# EasyEDA Pro project HNDX.eprj, board PCB1_3
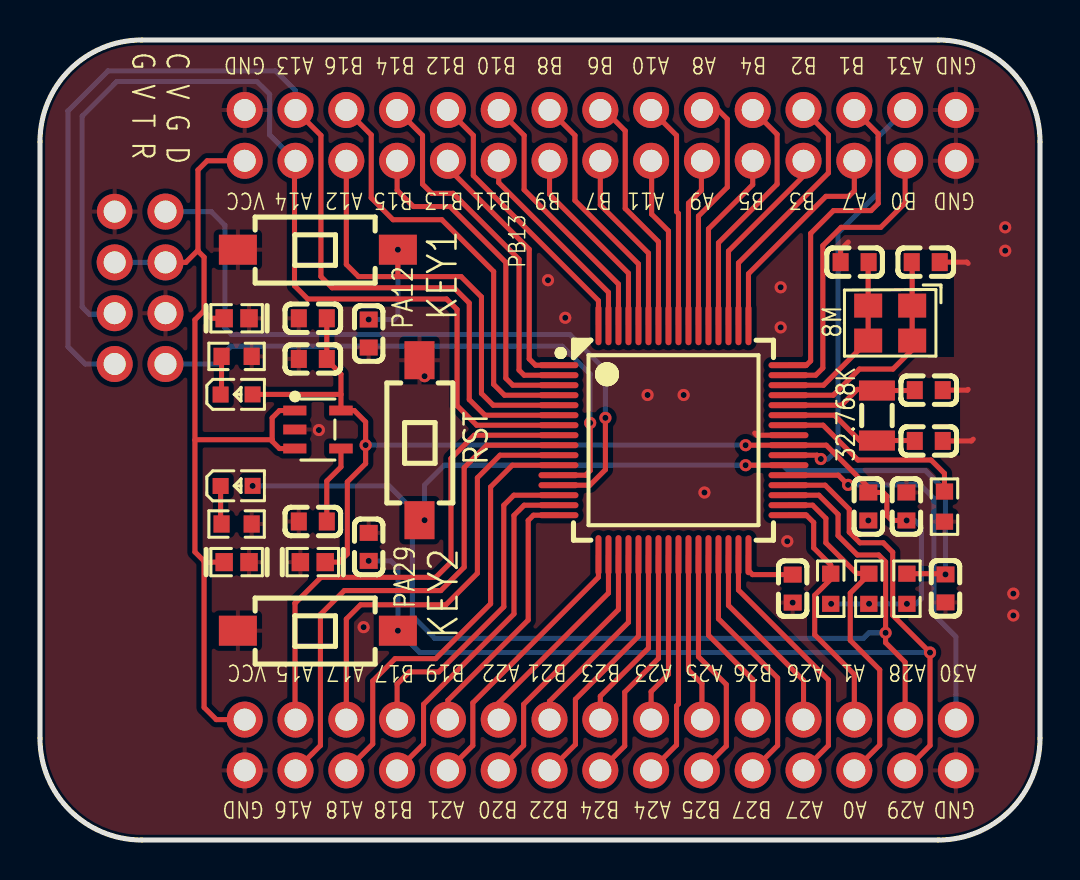
[diagram p9: board, top side]
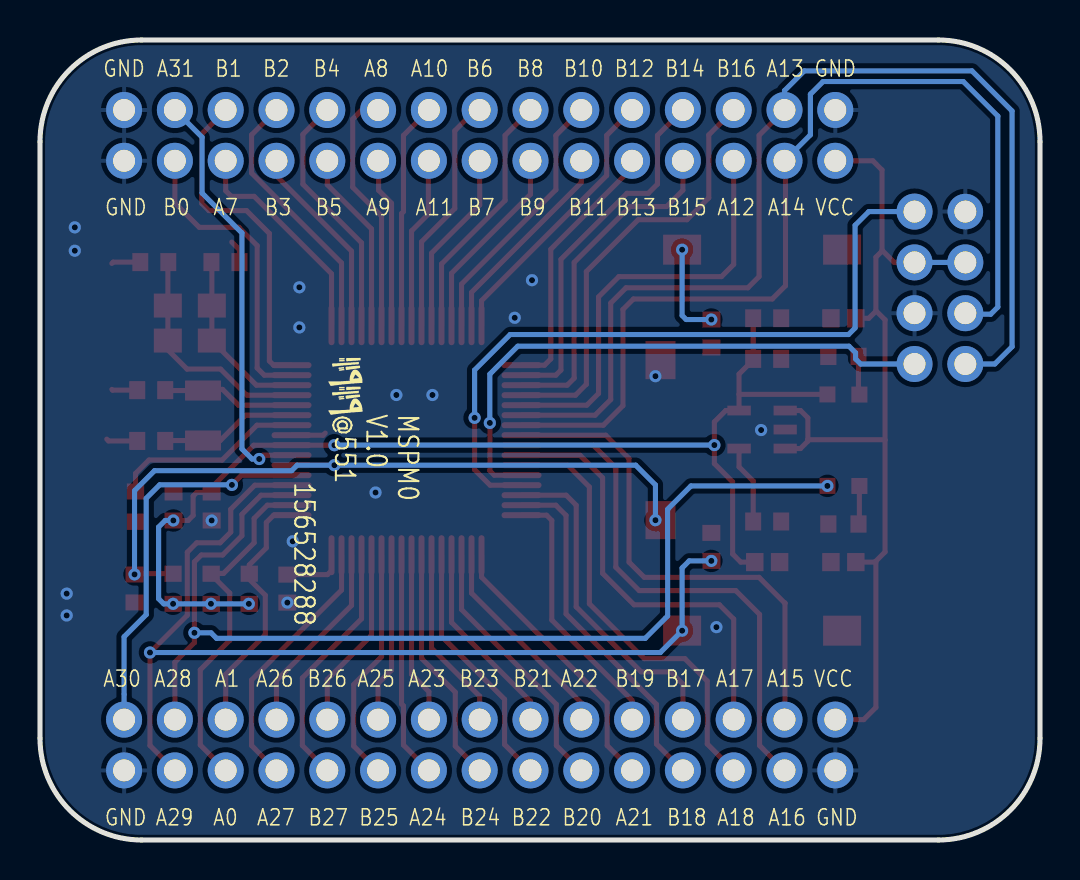
[diagram p10: board, bottom side, seen from below]

Outline 50 x 40 mm; copper layers: Top Layer, Bottom Layer. Coordinates in mm from the lower left corner of the outline.
Outline path: 0,34.92 arc(1.49,38.51) 5.08,40 44.92,40 arc(48.51,38.51) 50,34.92 50,5.08 arc(48.51,1.49) 44.92,0 5.08,0 arc(1.49,1.49) 0,5.08 0,34.92
Stack: Top Layer 0.035mm / Dielectric1 1.51mm FR4 er 4.5 / Bottom Layer 0.035mm

## Design rules (mm)
template: JLCPCB Capability(Two Layers Board)
spacing copperThickness1oz (default): track to track 0.102, other pairs 0.152 to 0.3
spacing copperThickness2oz: track to track 0.203, other pairs 0.152 to 0.3
track width copperThickness1oz (default): min 0.127, default 0.254, max 2.54
track width copperThickness2oz: min 0.203, default 0.254, max 2.54
differential pair differentialPair (default): width min 0.127, default 0.254, max 2.54; gap min 0.152, default 0.152
via viaSize (default): diameter min 0.5, default 0.61, max 10; hole min 0.3, default 0.305, max 6.3

## Placement (name value [footprint] x y rotation side)
C1  10nF  [C0603]  45.27 12.58 90 top
C2  470nF  [C0603]  37.63 12.57 90 top
C3  10uF  [C0603]  43.32 16.68 270 top
C4  100nF  [C0603]  41.42 16.68 90 top
C5  22nF  [C0603]  13.64 15.93 0 top
C6  100nF  [C0603]  13.64 24.05 180 top
C7  10uF  [C0603]  13.64 26.09 180 top
C8  100nF  [C0603]  16.43 25.32 270 top
C9  100nF  [C0603]  16.43 14.66 270 top
C10  20pF  [C0603]  44.44 22.49 180 top
C11  20pF  [C0603]  44.44 19.95 180 top
C12  20pF  [C0603]  40.73 28.89 0 top
C13  20pF  [C0603]  44.29 28.89 180 top
D4  0603ESDA-05N  [D0603-BI]  9.83 13.89 180 top
D5  0603ESDA-05N  [D0603-BI]  13.64 13.89 0 top
D6  0603ESDA-05N  [D0603-BI]  9.83 26.09 180 top
H3  PZ254R-12-8P  [HDR-TH_8P-P2.54-H-M-R2-C4-S2.54]  5 27.61 270 top
LED1  NCD0603R1  [LED0603-RD_RED]  9.83 17.7 0 top
LED2  NCD0603R1  [LED0603-RD_RED]  9.83 22.28 0 top
R1  47kΩ  [R0603]  43.35 12.56 270 top
R2  1kΩ  [R0603]  41.44 12.56 270 top
R3  1kΩ  [R0603]  39.54 12.56 90 top
R4  100kΩ  [R0603]  45.22 16.67 90 top
R5  1kΩ  [R0603]  9.83 15.8 180 top
R6  1kΩ  [R0603]  9.83 24.18 180 top
SW1  TS-1101-C-W  [SW-SMD_L6.0-W3.3-LS8.0]  18.97 19.99 90 top
SW2  TS-1101-C-W  [SW-SMD_L6.0-W3.3-LS8.0]  13.89 29.52 0 top
SW3  TS-1101-C-W  [SW-SMD_L6.0-W3.3-LS8.0]  13.89 10.47 0 top
U2  RT9193  [SOT-23-5_L3.0-W1.7-P0.95-LS2.8-BL]  13.89 20.52 270 top
U3  MSPM0G3507SPMR  [LQFP-64_L10.0-W10.0-P0.50-LS12.0-BL]  31.67 19.99 270 top
U12  PZ254-2-15-Z-8.5  [HDR-TH_30P-P2.54-V-M-R2-C15-S2.54]  28.02 35.23 0 top
U13  PZ254-2-15-Z-8.5  [HDR-TH_30P-P2.54-V-M-R2-C15-S2.54]  28.02 4.75 0 top
X1  32.768kHz  [FC-135R_L3.2-W1.5]  41.85 21.22 90 top
X2  8MHz  [CRYSTAL-SMD_4P-L3.2-W2.5-BL-1]  42.51 25.85 180 top

## Footprints (pads in the part's own frame, mm; a bottom-side part is the same pattern mirrored in y, then rotated)
C0603
  rect 0.8x0.9 smd: 1(-0.7,0) 2(0.7,0)
CRYSTAL-SMD_4P-L3.2-W2.5-BL-1
  rect 1.4x1.2 smd: 1(-1.1,-0.875) 2(1.1,-0.875) 3(1.1,0.875) 4(-1.1,0.875)
D0603-BI
  rect 0.873x0.907 smd: 1(-0.622,0) 2(0.622,0)
FC-135R_L3.2-W1.5
  rect 1x1.8 smd: 1(-1.25,0) 2(1.25,0)
HDR-TH_8P-P2.54-H-M-R2-C4-S2.54
  round 1.778 hole 1.1: 1(-3.81,-1.27)
  round 1.8 hole 1.1: 2(-3.81,1.27) 3(-1.27,-1.27) 4(-1.27,1.27) 5(1.27,-1.27) 6(1.27,1.27) 7(3.81,-1.27) 8(3.81,1.27)
HDR-TH_30P-P2.54-V-M-R2-C15-S2.54
  round 1.8 hole 1.1: 1(-17.78,-1.27) 2(-17.78,1.27) 3(-15.24,-1.27) 4(-15.24,1.27) 5(-12.7,-1.27) 6(-12.7,1.27) 7(-10.16,-1.27) 8(-10.16,1.27) 9(-7.62,-1.27) 10(-7.62,1.27) 11(-5.08,-1.27) 12(-5.08,1.27) 13(-2.54,-1.27) 14(-2.54,1.27) 15(0,-1.27) 16(0,1.27) 17(2.54,-1.27) 18(2.54,1.27) 19(5.08,-1.27) 20(5.08,1.27) 21(7.62,-1.27) 22(7.62,1.27) 23(10.16,-1.27) 24(10.16,1.27) 25(12.7,-1.27) 26(12.7,1.27) 27(15.24,-1.27) 28(15.24,1.27) 29(17.78,-1.27) 30(17.78,1.27)
LED0603-RD_RED
  rect 0.8x0.8 smd: 1(-0.799,-0.004) 2(0.799,0.004)
LQFP-64_L10.0-W10.0-P0.50-LS12.0-BL
  oval 0.3x2 smd: 1(-3.75,-5.75) 2(-3.25,-5.75) 3(-2.75,-5.75) 4(-2.25,-5.75) 5(-1.75,-5.75) 6(-1.25,-5.75) 7(-0.75,-5.75) 8(-0.25,-5.75) 9(0.25,-5.75) 10(0.75,-5.75) 11(1.25,-5.75) 12(1.75,-5.75) 13(2.25,-5.75) 14(2.75,-5.75) 15(3.25,-5.75) 16(3.75,-5.75) 33(3.75,5.75) 34(3.25,5.75) 35(2.75,5.75) 36(2.25,5.75) 37(1.75,5.75) 38(1.25,5.75) 39(0.75,5.75) 40(0.25,5.75) 41(-0.25,5.75) 42(-0.75,5.75) 43(-1.25,5.75) 44(-1.75,5.75) 45(-2.25,5.75) 46(-2.75,5.75) 47(-3.25,5.75) 48(-3.75,5.75)
  oval 2x0.3 smd: 17(5.75,-3.75) 18(5.75,-3.25) 19(5.75,-2.75) 20(5.75,-2.25) 21(5.75,-1.75) 22(5.75,-1.25) 23(5.75,-0.75) 24(5.75,-0.25) 25(5.75,0.25) 26(5.75,0.75) 27(5.75,1.25) 28(5.75,1.75) 29(5.75,2.25) 30(5.75,2.75) 31(5.75,3.25) 32(5.75,3.75) 49(-5.75,3.75) 50(-5.75,3.25) 51(-5.75,2.75) 52(-5.75,2.25) 53(-5.75,1.75) 54(-5.75,1.25) 55(-5.75,0.75) 56(-5.75,0.25) 57(-5.75,-0.25) 58(-5.75,-0.75) 59(-5.75,-1.25) 60(-5.75,-1.75) 61(-5.75,-2.25) 62(-5.75,-2.75) 63(-5.75,-3.25) 64(-5.75,-3.75)
R0603
  rect 0.806x0.864 smd: 1(-0.753,0) 2(0.753,0)
SOT-23-5_L3.0-W1.7-P0.95-LS2.8-BL
  rect 0.49x1.157 smd: 1(-0.95,-1.153) 2(0,-1.153) 3(0.95,-1.153)
  rect 0.49x1.175 smd: 4(0.95,1.153) 5(-0.95,1.153)
SW-SMD_L6.0-W3.3-LS8.0
  rect 1.9x1.5 smd: 1(-4,0) 2(4,0)

## Nets
As in the schematic.

## Via types
v1: diameter 0.61, hole 0.305, Top Layer to Bottom Layer, 37 vias

## Routing (per net, layer and track width the routed paths; a pad name or vN(x,y) marks a point on that pad's centre or on a via; arc(x,y) is an arc through that point)
3V3: length 57.4
  Top Layer w0.254: v1(35.28,19.74) U3.40 39.31,19.74 41.42,17.64 C4.2 42.16,17.38 42.34,17.2 42.34,16.23 42.6,15.98 C3.2 ; C7.1 C6.1 14.34,24 15.05,23.3 U2.5 15.71,21.47 16.28,20.9 v1(16.28,19.75) 16.28,18.82 15.37,17.91 15.37,14.3 14.96,13.89 D5.2 ; LED2.2 15.05,22.28
  Bottom Layer w0.254: v1(39.56,11.81) v1(43.35,11.81) 43.81,11.81 44.07,12.07 44.07,15.65 43.74,15.98 v1(43.33,15.98) ; v1(16.28,19.75) 35.28,19.75 v1(35.28,19.74)
  vias: v1(41.45,11.81)
GND: length 7.2
  Top Layer w0.254: 35.74,20.35 35.84,20.24 U3.41 ; C10.1 46.37,22.49 46.41,22.53 ; C13.1 46.34,28.89 46.41,28.83 ; 46.66,20.04 46.57,19.95 C11.1 ; 40.41,29.9 40.03,29.51 C12.1
  vias: v1(13.94,20.5) v1(16.18,10.64) v1(19.23,23.19) v1(25.4,27.99) v1(26.26,26.11) v1(30.38,22.25) v1(32.18,22.25) v1(33.22,17.37) v1(37.03,27.64) v1(37.03,25.63) v1(37.36,14.94) v1(37.63,11.87) v1(41.42,15.98) v1(48.26,30.63) v1(48.26,29.46) v1(48.67,12.32) v1(48.67,11.23)
VCC: length 46.4
  Top Layer w0.254: 7.88,29.47 7.29,28.88 H3.4 ; 7.88,29.47 7.9,29.49 7.9,33.5 8.36,33.96 U12.1 ; 7.88,29.47 8.2,29.14 8.2,26.47 ; 8.22,13.93 7.75,14.4 7.75,20 ; 8.22,13.93 8.2,13.91 8.2,6.63 8.81,6.02 U13.2 ; 8.22,13.93 8.25,13.89 D4.2 ; U2.1 11.97,21.47 11.61,21.11 11.61,20.01 ; 7.75,20 7.76,20.01 11.61,20.01 ; 7.75,20 7.75,26.01 8.2,26.47 ; 8.2,26.47 8.2,26.44 8.56,26.09 D6.2 ; 11.61,20.01 11.61,19.94 11.97,19.57 U2.3
  Bottom Layer w0.254: H3.3 H3.4
H_IN_1: length 8.7
  Top Layer w0.254: C12.2 41.41,28.87 X2.2 X2.3 39.18,22.74 37.53,22.74
H_IN_2: length 11.4
  Top Layer w0.254: 37.53,22.24 39.66,22.24 40.97,23.55 42.65,23.55 43.61,24.51 X2.4 X2.1 43.61,28.87 C13.2
L_IN_1: length 6.6
  Top Layer w0.254: C10.2 43.72,22.47 X1.2 41.79,22.53 40.87,22.53 40.08,21.74 37.53,21.74
L_IN_2: length 6.7
  Top Layer w0.254: C11.2 43.72,19.97 X1.1 40.99,19.97 39.72,21.24 37.53,21.24
NRST: length 37
  Top Layer w0.254: v1(35.28,18.74) U3.38 ; R1.1 45.24,13.32 v1(45.27,13.28)
  Bottom Layer w0.254: v1(19.23,15.99) 19.23,17.75 20.21,18.74 v1(35.28,18.74) 37.14,18.74 37.42,18.47 44.27,18.47 45.27,17.46 v1(45.27,13.28)
PA0: length 17.5
  Top Layer w0.254: 41.43,13.33 41.43,13.26 40.51,12.34 40.51,9.98 41.99,8.51 41.99,4.75 U13.25 ; 41.43,13.33 R2.1 ; 41.43,13.33 40.82,13.33 39.29,14.86 39.29,16.08 38.63,16.74 U3.34
PA1: length 12.8
  Top Layer w0.254: U3.33 38.32,16.24 38.68,15.88 38.68,14.61 39.54,13.75 R3.2 39.54,13.04 38.74,12.24 38.74,10.26 40.72,8.28 U13.26
PA7: length 11.1
  Top Layer w0.254: U3.49 35.42,28.31 39.29,32.18 40.44,32.18 40.72,32.46 U12.25
PA8: length 12.4
  Top Layer w0.254: U12.20 33.91,36.5 34.37,36.04 34.37,32.64 32.92,31.2 U3.54
PA9: length 8.5
  Top Layer w0.254: U3.55 32.42,31.84 33.07,32.49 33.07,33.93 U12.19
PA10: length 11.3
  Top Layer w0.254: U3.56 31.92,31.32 31.83,31.42 31.83,35.23 U12.18
PA11: length 8.6
  Top Layer w0.254: U3.57 31.42,30.45 30.58,31.29 30.58,33.93 U12.17
PA12: length 27.7
  Top Layer w0.254: 17.91,28.22 17.89,28.23 v1(17.89,29.52) ; U3.5 22.66,21.74 22.07,22.33 22.07,27.15 21.06,28.17 15.93,28.17 15.32,28.78 U12.5
  Bottom Layer w0.254: v1(17.89,29.52) 17.89,26.23 17.69,26.02 v1(16.43,26.02)
PA13: length 54.5
  Top Layer w0.254: U12.4 14.05,35.23 14.05,28.17 14.61,27.61 20.7,27.61 21.46,26.85 21.46,22.02 22.25,21.24 U3.6
  Bottom Layer w0.254: H3.7 2.26,23.8 1.4,24.66 1.4,36.45 3.4,38.46 11.79,38.46 12.78,37.47 U12.4
PA14: length 50.7
  Top Layer w0.254: U12.3 12.73,33.91 12.73,27.71 13.39,27.05 20.33,27.05 20.85,26.53 20.85,21.72 21.83,20.74 U3.7
  Bottom Layer w0.254: U12.3 11.48,35.26 11.48,37.29 10.85,37.92 3.84,37.92 2.11,36.2 2.11,26.65 2.46,26.29 3.71,26.29 3.73,26.31
PA15: length 25.5
  Top Layer w0.254: 12.75,11.84 14.05,13.13 19.79,13.13 20.55,13.89 20.55,19.08 21.71,20.24 U3.8 ; 12.75,11.84 12.75,6.05 U13.4 ; 12.75,11.84 12.75,11.86
PA16: length 26.6
  Top Layer w0.254: U3.9 22.33,19.74 21.21,18.62 21.21,13.64 20.04,12.47 15.22,12.47 14.02,11.28 14.02,4.72 13.61,4.31 ; 13.59,4.29 U13.3
PA17: length 21.8
  Top Layer w0.254: U13.6 15.32,11.05 16.03,11.76 20.3,11.76 21.87,13.34 21.87,18.11 23,19.24 U3.10
PA18: length 22.2
  Top Layer w0.254: U13.5 16.64,4.8 16.64,7.95 17.75,9.07 19.79,9.07 22.53,11.81 22.53,17.65 23.62,18.74 U3.11
PA21: length 13.9
  Top Layer w0.254: U3.17 27.92,13.14 21.64,6.86 21.64,4.72 U13.9
PA22: length 10.5
  Top Layer w0.254: U3.18 28.42,12.35 22.94,6.86 U13.12
PA23: length 8.6
  Top Layer w0.254: U3.24 31.42,8.28 30.56,7.42 U13.18
PA24: length 11.3
  Top Layer w0.254: U3.25 31.92,6.8 31.83,6.71 31.83,4.75 U13.17
PA25: length 8.5
  Top Layer w0.254: U13.20 33.1,7.82 32.42,8.5 U3.26
PA26: length 9.8
  Top Layer w0.254: U13.24 38.18,7.98 34.42,11.73 U3.30
PA27: length 13.1
  Top Layer w0.254: U13.23 39.42,4.72 39.42,8 34.92,12.5 U3.31
PA28: length 53.2
  Top Layer w0.254: U13.28 43.26,8.89 42.28,9.87 v1(42.28,10.36) 42.28,13.91 41.94,14.25 40.87,14.25 39.9,15.22 39.9,16.28 38.95,17.24 U3.35
  Bottom Layer w0.254: v1(10.63,17.7) 17.45,17.7 18.62,16.54 18.62,11.2 19.74,10.08 41.17,10.08 41.45,10.36 v1(42.28,10.36)
PA29: length 51.3
  Top Layer w0.254: U13.27 44.5,4.72 v1(44.5,9.37) 42.64,11.24 42.64,14.39 42.16,14.86 41,14.86 40.46,15.39 40.46,16.54 39.26,17.74 U3.36
  Bottom Layer w0.254: v1(16.43,13.96) 17.54,13.96 17.89,13.6 v1(17.89,10.47) 18.99,9.37 v1(44.5,9.37)
PA30: length 19.2
  Top Layer w0.254: v1(40.41,17.76) 39.92,18.24 U3.37
  Bottom Layer w0.254: 45.8,7.26 U13.30 ; v1(40.41,17.76) 40.41,17.76 44.01,17.76 44.69,17.08 44.69,11.27 45.8,10.16 45.8,7.3
PA31: length 21.1
  Top Layer w0.254: U3.39 38.85,19.24 v1(39.04,19.05)
  Bottom Layer w0.254: v1(39.04,19.05) 39.4,19.05 39.9,19.56 39.9,30.35 41.9,32.35 41.9,35.14 U12.28
PB0: length 15.1
  Top Layer w0.254: U12.27 43.26,31.85 42.04,30.63 40.06,30.63 39.14,29.72 39.14,23.6 38.78,23.24 U3.47
PB1: length 16.7
  Top Layer w0.254: U12.26 41.91,35.31 41.91,31.83 41.55,31.47 39.68,31.47 38.53,30.33 38.53,23.95 38.32,23.74 U3.48
PB2: length 13.1
  Top Layer w0.254: U12.24 39.42,35.26 39.42,33.35 34.92,28.85 U3.50
PB3: length 9.8
  Top Layer w0.254: U12.23 38.18,33.2 34.42,29.45 U3.51
PB4: length 12.5
  Top Layer w0.254: U12.22 36.86,35.28 36.86,32.79 33.92,29.86 U3.52
PB5: length 9.1
  Top Layer w0.254: U12.21 35.64,32.77 33.42,30.55 U3.53
PB6: length 12.1
  Top Layer w0.254: U12.16 28.22,36.5 29.26,35.46 29.26,31.57 30.92,29.91 U3.58
PB7: length 9.2
  Top Layer w0.254: U12.15 28.02,31.75 30.42,29.34 U3.59
PB8: length 12.6
  Top Layer w0.254: U12.14 26.75,35.23 26.75,31.98 29.92,28.8 U3.60
PB9: length 9.9
  Top Layer w0.254: U3.61 29.42,28.34 25.48,32.28 U12.13
PB10: length 13.2
  Top Layer w0.254: U12.12 24.21,35.23 24.21,32.51 28.92,27.79 U3.62
PB11: length 10.5
  Top Layer w0.254: U3.63 28.42,27.38 22.94,32.87 U12.11
PB12: length 13.9
  Top Layer w0.254: U12.10 21.67,35.23 21.67,33.22 27.92,26.97 U3.64
PB13: length 13.2
  Top Layer w0.254: U12.9 20.4,33.6 24.46,29.54 24.46,24.05 24.77,23.74 U3.1
PB14: length 18.2
  Top Layer w0.254: U3.2 24.21,23.24 23.95,23.5 23.95,29.03 20.65,32.33 19.58,32.33 19.13,32.79 19.13,35.23 U12.8
PB15: length 17
  Top Layer w0.254: U3.3 23.64,22.74 23.29,23.09 23.29,28.88 20.5,31.67 18.67,31.67 17.86,32.49 U12.7
PB16: length 21.7
  Top Layer w0.254: U3.4 23.23,22.24 22.68,22.78 22.68,28.42 20.09,31.01 17.65,31.01 16.56,32.11 16.56,35.26 U12.6
PB17: length 16.7
  Top Layer w0.254: U3.14 23.69,17.24 23.19,16.74 23.19,11.66 19.94,8.41 18.47,8.41 17.86,7.8 U13.8
PB18: length 17.6
  Top Layer w0.254: U3.15 24.21,16.74 23.7,16.23 23.7,11.3 19.18,6.78 19.18,4.8 U13.7
PB19: length 13.2
  Top Layer w0.254: U3.16 24.67,16.24 24.41,15.98 24.41,11 20.4,6.99 U13.10
PB20: length 13.2
  Top Layer w0.254: U13.11 24.18,4.72 24.18,6.78 28.92,11.53 U3.19
PB21: length 9.9
  Top Layer w0.254: U3.20 29.42,10.88 25.48,6.93 U13.14
PB22: length 12.6
  Top Layer w0.254: U3.21 29.92,10.19 26.77,7.04 26.77,4.78 U13.13
PB23: length 9.2
  Top Layer w0.254: U3.22 30.42,9.6 28.02,7.19 U13.16
PB24: length 12
  Top Layer w0.254: U3.23 30.92,9.08 29.24,7.39 29.24,4.7 U13.15
PB25: length 11.8
  Top Layer w0.254: U3.27 32.92,9.16 34.32,7.77 34.32,4.7 U13.19
PB26: length 9.1
  Top Layer w0.254: U3.28 33.42,10.24 35.64,8.03 U13.22
PB27: length 12.5
  Top Layer w0.254: U13.21 36.88,4.72 36.88,8.1 33.92,11.06 U3.29
SWCLK: length 35.9
  Top Layer w0.254: U3.13 27.49,17.74 28.27,18.52 v1(28.27,21.11)
  Bottom Layer w0.254: H3.2 8.56,31.42 9.25,30.73 9.25,25.6 9.58,25.27 26.49,25.27 28.27,23.5 v1(28.27,21.11)
SWDIO: length 28.9
  Top Layer w0.254: U3.12 27.28,18.24 27.51,18.47 v1(27.51,20.85)
  Bottom Layer w0.254: v1(27.51,20.85) 27.51,23.29 26.11,24.69 9.55,24.69 9.22,24.36 9.22,24.05 8.97,23.8 H3.8
$1N1418: length 3.9
  Top Layer w0.254: U2.4 15.05,18.65 14.34,17.95 C5.2
$1N2545: length 1.9
  Top Layer w0.254: R6.2 9.08,22.32 LED2.1
$1N7826: length 9.6
  Top Layer w0.254: 37.53,20.74 39.15,20.74 40.89,19 44.55,19 45.22,18.33 R4.2
$1N8188: length 3.1
  Top Layer w0.254: C2.2 35.63,13.27 35.42,13.47 U3.32
$1N18671: length 1.9
  Top Layer w0.254: R5.2 9.03,15.85 LED1.1

## Copper pours and planes (outline as drawn; the poured copper is in the pictures)
GND on Top Layer: -0.23,40.01 50.17,40.01 50.17,-0.08 -0.23,-0.08
GND on Bottom Layer: 0.02,40.01 50.11,40.01 50.11,-0.08 0.02,-0.08

## Text on the board
Bottom Silkscreen Layer: GND | VCC | A16 | A14 | A15 | A13 | A12 | A18 | B16 | A17 | B15 | B18 | B17 | B14 | B13 | A21 | B19 | B12 | B11 | B10 | B20 | A22 | B9 | B8 | B21 | B22 | B7 | B6 | B24 | B23 | A11 | A10 | A24 | A23 | A9 | A8 | B25 | A25 | B5 | B4 | B27 | B26 | B3 | B2 | A27 | A26 | B1 | A1 | A7 | A0 | B0 | A31 | A29 | A28 | A30 | MSPM0 / V1.0 / @551 | 156528288
Document Layer: EDS | 5V(TYPEC)与3.3V请勿同时供电 | 符号V代表供电 | T与R对应UART1的TX与RX(PC4 PC5) | 信息与警告：
Top Silkscreen Layer: PB13 | GND | VCC | A16 | A14 | A15 | A13 | A12 | A18 | B16 | A17 | B15 | B18 | B17 | B14 | B13 | A21 | B19 | B12 | B11 | B10 | B20 | A22 | B9 | B8 | B21 | B22 | B7 | B6 | B24 | B23 | A11 | A10 | A24 | A23 | A9 | A8 | B25 | A25 | B5 | B4 | B27 | B26 | B3 | B2 | A27 | A26 | B1 | A1 | A7 | A0 | B0 | A31 | A29 | A28 | A30 | 8M | 32.768K | PA12 | PA29 | C V G D / G V T R | RST | KEY1 | KEY2
